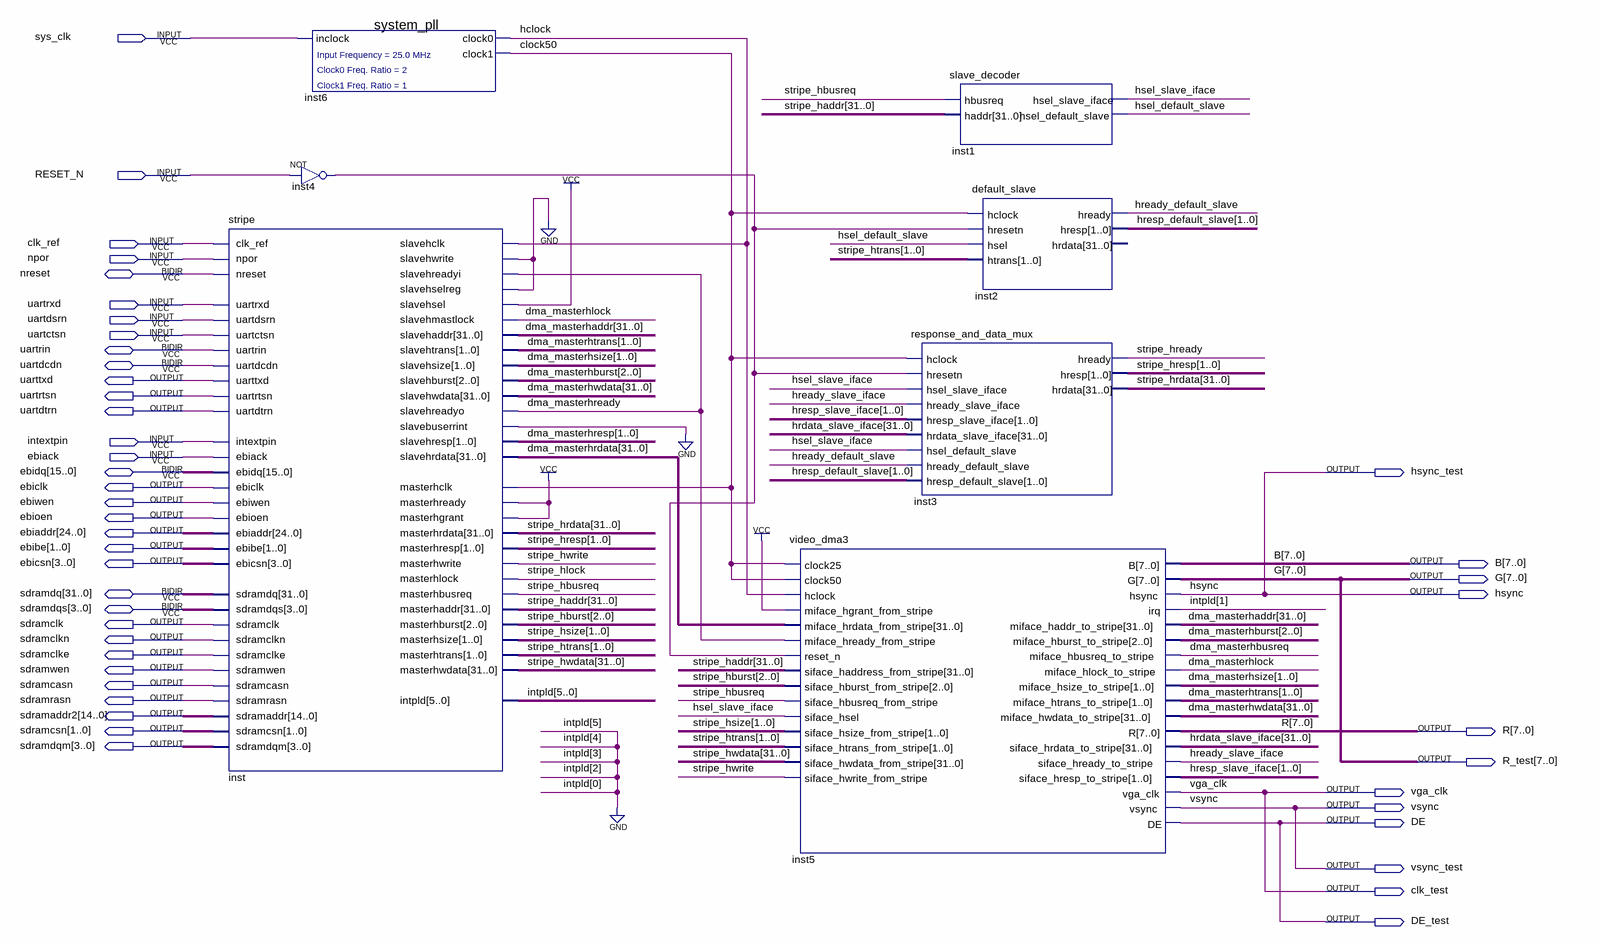
[diagram p0: schematic sheet]
// Quartus schematic arm_top.bdf as structural Verilog: 7 symbols, 45 pins
module arm_top (
  input  sys_clk,
  input  RESET_N,
  input  clk_ref,
  input  npor,
  input  uartrxd,
  input  uartdsrn,
  input  uartctsn,
  input  intextpin,
  input  ebiack,
  inout  nreset,
  inout  uartrin,
  inout  uartdcdn,
  inout  [15:0] ebidq,
  inout  [31:0] sdramdq,
  inout  [3:0] sdramdqs,
  output uarttxd,
  output uartrtsn,
  output uartdtrn,
  output hsync_test,
  output ebiclk,
  output ebiwen,
  output ebioen,
  output [24:0] ebiaddr,
  output [1:0] ebibe,
  output [3:0] ebicsn,
  output [7:0] B,
  output [7:0] G,
  output hsync,
  output sdramclk,
  output sdramclkn,
  output sdramclke,
  output sdramwen,
  output sdramcasn,
  output sdramrasn,
  output [14:0] sdramaddr2,
  output [1:0] sdramcsn,
  output [7:0] R,
  output [3:0] sdramdqm,
  output [7:0] R_test,
  output vga_clk,
  output vsync,
  output DE,
  output vsync_test,
  output clk_test,
  output DE_test
);

  wire clock50, dma_masterhbusreq, dma_masterhlock, dma_masterhready, hclock, hready_default_slave,
       hready_slave_iface, hsel_default_slave, hsel_slave_iface, inst4_out, inst_slavebuserrint,
       stripe_hbusreq, stripe_hlock, stripe_hready, stripe_hwrite;
  wire [1:0] dma_masterhresp, dma_masterhsize, dma_masterhtrans, hresp_default_slave, hresp_slave_iface,
       stripe_hresp, stripe_hsize, stripe_htrans;
  wire [1:1] intpld;
  wire [2:0] dma_masterhburst, stripe_hburst;
  wire [31:0] dma_masterhaddr, dma_masterhrdata, dma_masterhwdata, hrdata_slave_iface, stripe_haddr,
       stripe_hrdata, stripe_hwdata;

  stripe inst (
    .clk_ref(clk_ref), .npor(npor), .uartrxd(uartrxd), .uartdsrn(uartdsrn), .uartctsn(uartctsn),
    .intextpin(intextpin), .ebiack(ebiack), .slavehclk(hclock), .slavehwrite(1'b0),
    .slavehreadyi(dma_masterhready), .slavehselreg(1'b0), .slavehsel(1'b1), .slavehmastlock(dma_masterhlock),
    .slavehaddr(dma_masterhaddr), .slavehtrans(dma_masterhtrans), .slavehsize(dma_masterhsize),
    .slavehburst(dma_masterhburst), .slavehwdata(dma_masterhwdata), .masterhclk(clock50),
    .masterhready(1'b1), .masterhgrant(1'b1), .masterhrdata(stripe_hrdata), .masterhresp(stripe_hresp),
    .intpld({4'b0000, intpld[1], 1'b0}), .uarttxd(uarttxd), .uartrtsn(uartrtsn), .uartdtrn(uartdtrn),
    .ebiclk(ebiclk), .ebiwen(ebiwen), .ebioen(ebioen), .ebiaddr(ebiaddr), .ebibe(ebibe), .ebicsn(ebicsn),
    .sdramclk(sdramclk), .sdramclkn(sdramclkn), .sdramclke(sdramclke), .sdramwen(sdramwen),
    .sdramcasn(sdramcasn), .sdramrasn(sdramrasn), .sdramaddr(sdramaddr2), .sdramcsn(sdramcsn),
    .sdramdqm(sdramdqm), .slavehreadyo(dma_masterhready), .slavebuserrint(inst_slavebuserrint),
    .slavehresp(dma_masterhresp), .slavehrdata(dma_masterhrdata), .masterhwrite(stripe_hwrite),
    .masterhlock(stripe_hlock), .masterhbusreq(stripe_hbusreq), .masterhaddr(stripe_haddr),
    .masterhburst(stripe_hburst), .masterhsize(stripe_hsize), .masterhtrans(stripe_htrans),
    .masterhwdata(stripe_hwdata), .nreset(nreset), .uartrin(uartrin), .uartdcdn(uartdcdn), .ebidq(ebidq),
    .sdramdq(sdramdq), .sdramdqs(sdramdqs));
  system_pll inst6 (.inclock(sys_clk), .clock0(hclock), .clock1(clock50));
  not inst4 (inst4_out, RESET_N);
  video_dma3 inst5 (
    .clock25(clock50), .clock50(clock50), .hclock(hclock), .miface_hgrant_from_stripe(1'b1),
    .miface_hrdata_from_stripe(dma_masterhrdata), .miface_hready_from_stripe(dma_masterhready),
    .reset_n(inst4_out), .siface_haddress_from_stripe(stripe_haddr),
    .siface_hburst_from_stripe(stripe_hburst), .siface_hbusreq_from_stripe(stripe_hbusreq),
    .siface_hsel(hsel_slave_iface), .siface_hsize_from_stripe(stripe_hsize),
    .siface_htrans_from_stripe(stripe_htrans), .siface_hwdata_from_stripe(stripe_hwdata),
    .siface_hwrite_from_stripe(stripe_hwrite), .B(B), .G(G), .hsync(hsync), .irq(intpld[1]),
    .miface_haddr_to_stripe(dma_masterhaddr), .miface_hburst_to_stripe(dma_masterhburst),
    .miface_hbusreq_to_stripe(dma_masterhbusreq), .miface_hlock_to_stripe(dma_masterhlock),
    .miface_hsize_to_stripe(dma_masterhsize), .miface_htrans_to_stripe(dma_masterhtrans),
    .miface_hwdata_to_stripe(dma_masterhwdata), .R(R), .siface_hrdata_to_stripe(hrdata_slave_iface),
    .siface_hready_to_stripe(hready_slave_iface), .siface_hresp_to_stripe(hresp_slave_iface),
    .vga_clk(clk_test), .vsync(vsync), .DE(DE));
  response_and_data_mux inst3 (
    .hclock(clock50), .hresetn(inst4_out), .hsel_slave_iface(hsel_slave_iface),
    .hready_slave_iface(hready_slave_iface), .hresp_slave_iface(hresp_slave_iface),
    .hrdata_slave_iface(hrdata_slave_iface), .hsel_default_slave(hsel_slave_iface),
    .hready_default_slave(hready_default_slave), .hresp_default_slave(hresp_default_slave),
    .hready(stripe_hready), .hresp(stripe_hresp), .hrdata(stripe_hrdata));
  slave_decoder inst1 (
    .hbusreq(stripe_hbusreq), .haddr(stripe_haddr), .hsel_slave_iface(hsel_slave_iface),
    .hsel_default_slave(hsel_default_slave));
  default_slave inst2 (
    .hclock(clock50), .hresetn(inst4_out), .hsel(hsel_default_slave), .htrans(stripe_htrans),
    .hready(hready_default_slave), .hresp(hresp_default_slave));  // open: hrdata

  assign DE_test = DE;
  assign hsync_test = hsync;
  assign R_test = G;
  assign vga_clk = clk_test;
  assign vsync_test = vsync;
  // also tied to GND on the sheet: inst_slavebuserrint
endmodule
